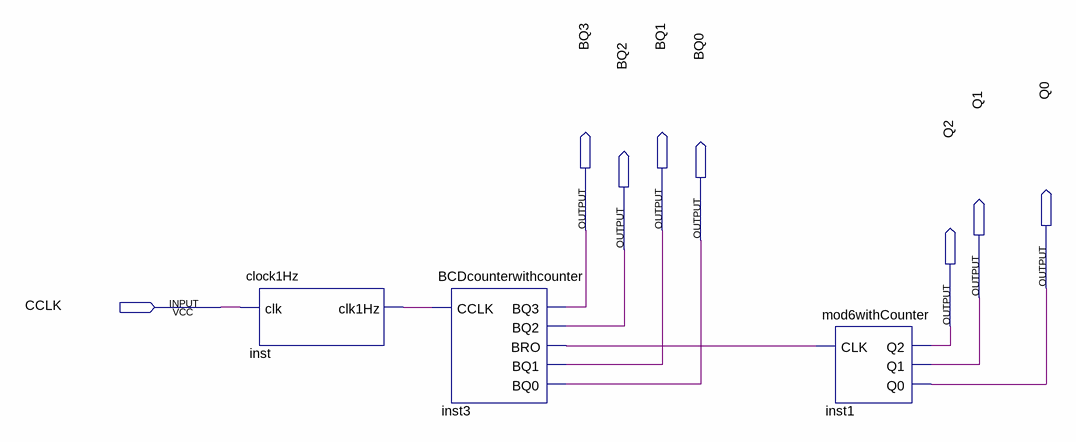
[diagram p0: schematic sheet]
// Quartus schematic mod60WithCounter.bdf as structural Verilog: 3 symbols, 8 pins
module mod60WithCounter (
  input  CCLK,
  output BQ3,
  output BQ1,
  output BQ0,
  output BQ2,
  output Q0,
  output Q1,
  output Q2
);

  wire inst3_bro, inst_clk1hz;

  clock1Hz inst (.clk(CCLK), .clk1Hz(inst_clk1hz));
  BCDcounterwithcounter inst3 (.CCLK(inst_clk1hz), .BQ3(BQ3), .BQ2(BQ2), .BRO(inst3_bro), .BQ1(BQ1), .BQ0(BQ0));
  mod6withCounter inst1 (.CLK(inst3_bro), .Q2(Q2), .Q1(Q1), .Q0(Q0));
endmodule
